# EAGLE design CMOS Clock battery (EAGLE 9.6.2)
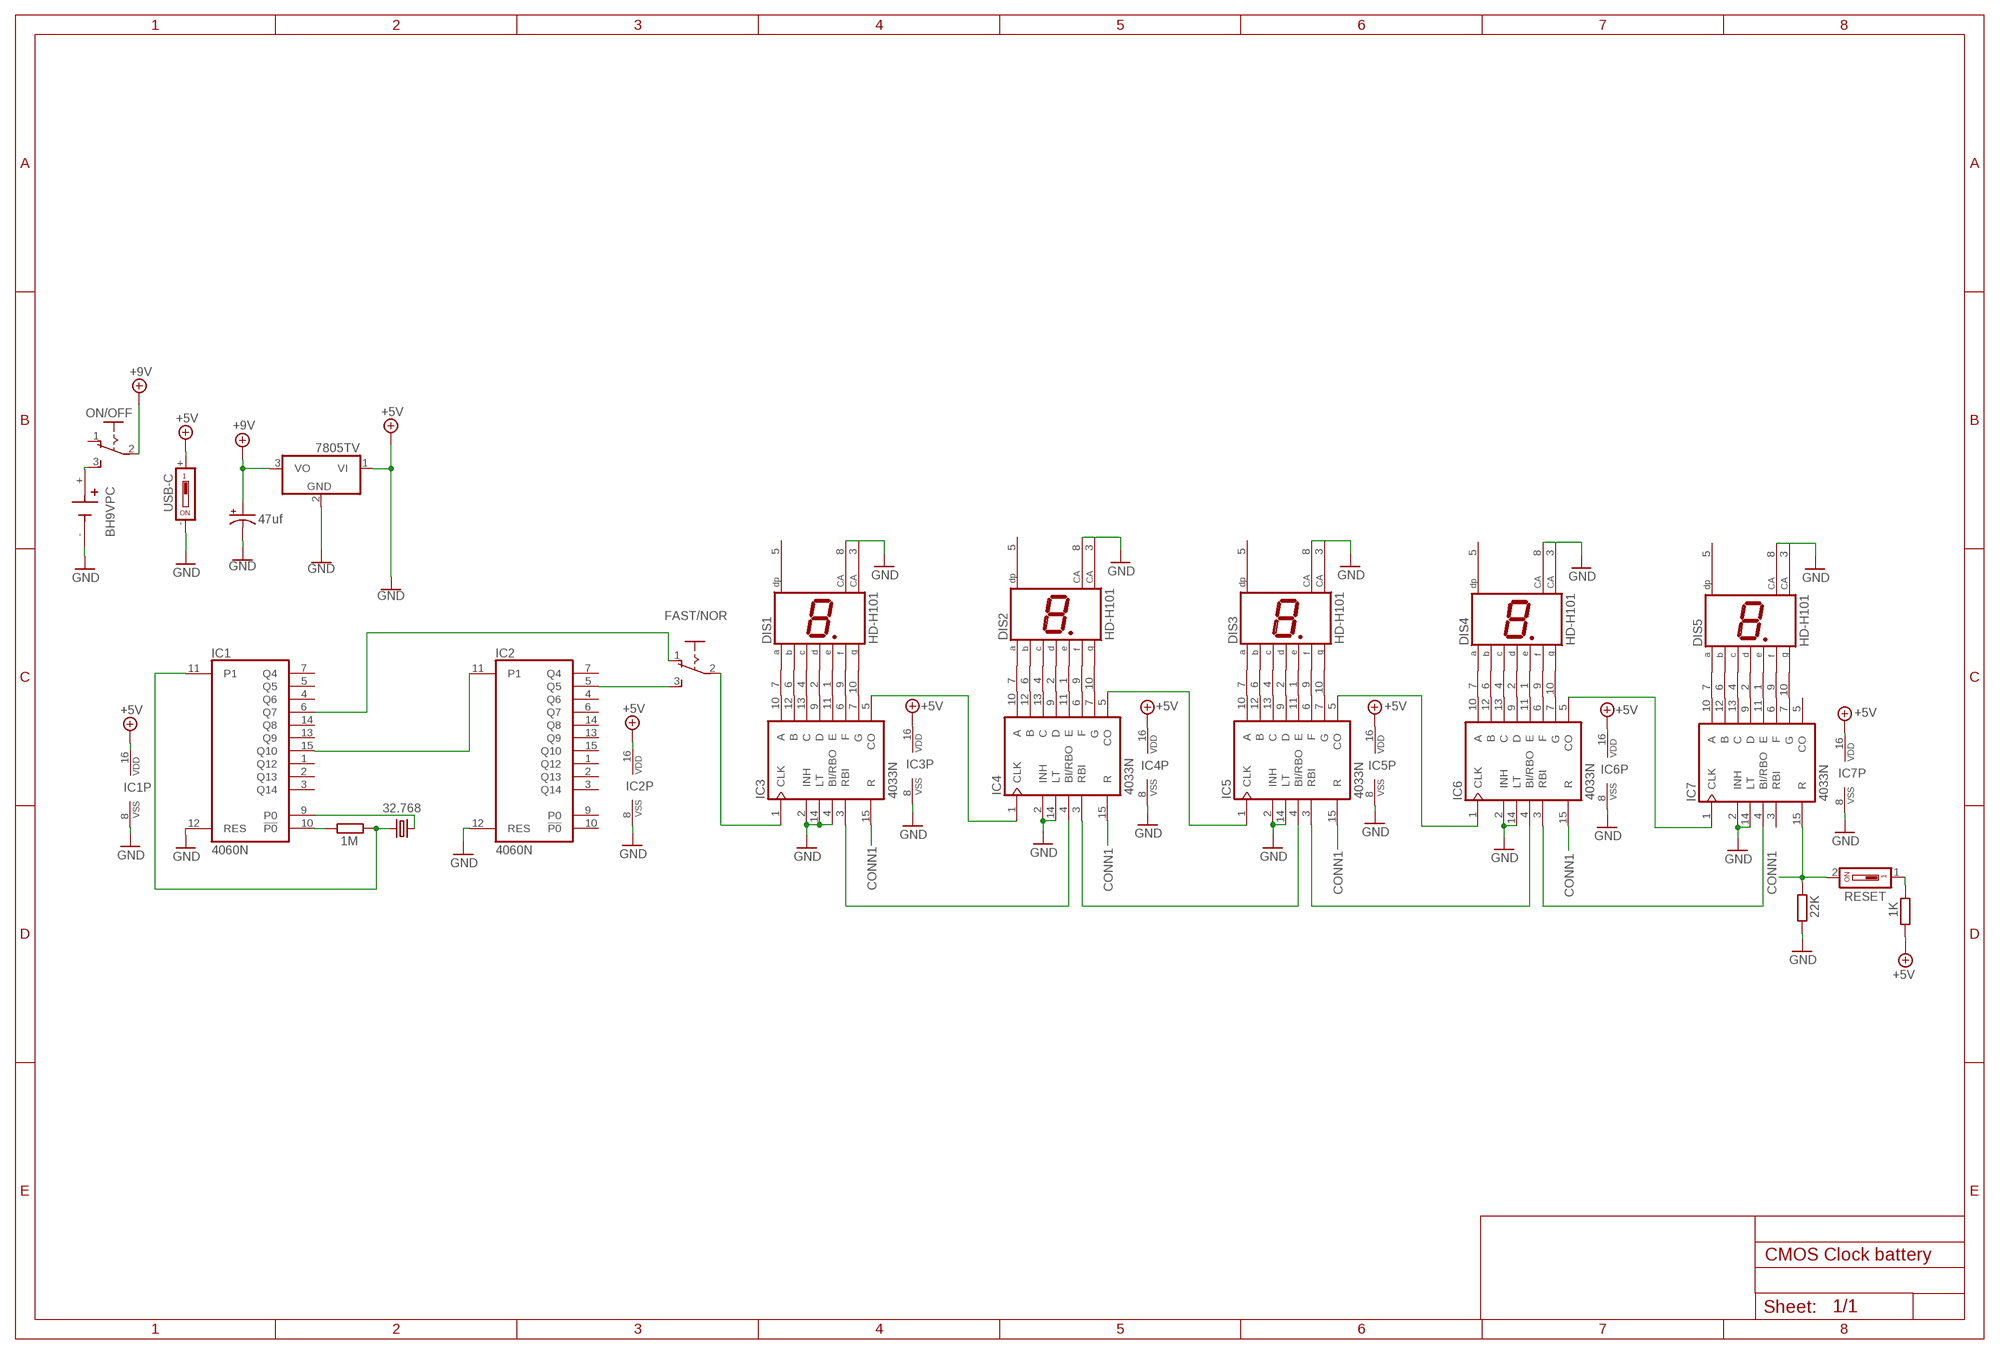
[diagram p0: schematic, sheet 1]

## Parts
BT1  BH9VPC  [BAT_BH9VPC]
C14  47uf  CPOL-USE2-5  [E2-5]
DIS1  HD-H101  [HDSP-M]
DIS2  HD-H101  [HDSP-M]
DIS3  HD-H101  [HDSP-M]
DIS4  HD-H101  [HDSP-M]
DIS5  HD-H101  [HDSP-M]
FAST/NOR  M251  [M251]
IC1  4060N  [DIL16]
IC2  4060N  [DIL16]
IC3  4033N  [DIL16]
IC4  4033N  [DIL16]
IC5  4033N  [DIL16]
IC6  4033N  [DIL16]
IC7  4033N  [DIL16]
IC8  7805TV  [TO220V]
ON/OFF  M251  [M251]
Q1  32.768  CRYSTALTC26H  [TC26H]
R1  1M  R-EU_0207/10  [0207/10]
R2  1K  R-EU_0207/10  [0207/10]
R3  22K  R-EU_0207/10  [0207/10]
RESET  DS01  [DS-01]
USB-C  USB-C  [DS-01]

## Nets
+5V: IC1.16(VDD) IC2.16(VDD) IC3.16(VDD) IC4.16(VDD) IC5.16(VDD) IC6.16(VDD) IC7.16(VDD) R2.2 USB-C.+
+9V: C14.+ IC8.3(VO) ON/OFF.2(P)
CONN1: IC3.15(R) IC4.15(R) IC5.15(R) IC6.15(R) IC7.15(R) R3.2 RESET.2
GND: BT1.- C14.- DIS1.3(CA) DIS1.8(CA) DIS2.3(CA) DIS2.8(CA) DIS3.3(CA) DIS3.8(CA) DIS4.3(CA) DIS4.8(CA) DIS5.3(CA) DIS5.8(CA) IC1.8(VSS) IC1.12(RES) IC2.8(VSS) IC2.12(RES) IC3.2(INH) IC3.4(BI/RBO) IC3.8(VSS) IC3.14(LT) IC4.2(INH) IC4.8(VSS) IC4.14(LT) IC5.2(INH) IC5.8(VSS) IC5.14(LT) IC6.2(INH) IC6.8(VSS) IC6.14(LT) IC7.2(INH) IC7.8(VSS) IC7.14(LT) IC8.1(VI) IC8.2(GND) R3.1 USB-C.- ; supply symbol labelled +5V
N$1: IC1.10(!P0) R1.1
N$2: IC1.11(P1) Q1.1 R1.2
N$3: IC1.9(P0) Q1.2
N$4: IC1.15(Q10) IC2.11(P1)
N$5: FAST/NOR.3(S) IC2.5(Q5)
N$6: DIS1.9(F) IC3.6(F)
N$7: DIS1.10(G) IC3.7(G)
N$8: DIS1.2(D) IC3.9(D)
N$9: DIS1.7(A) IC3.10(A)
N$10: DIS1.1(E) IC3.11(E)
N$11: DIS1.6(B) IC3.12(B)
N$12: DIS1.4(C) IC3.13(C)
N$13: IC3.5(CO) IC4.1(CLK)
N$14: IC4.5(CO) IC5.1(CLK)
N$15: DIS2.9(F) IC4.6(F)
N$16: DIS2.10(G) IC4.7(G)
N$17: DIS2.2(D) IC4.9(D)
N$18: DIS2.7(A) IC4.10(A)
N$19: DIS2.1(E) IC4.11(E)
N$20: DIS2.6(B) IC4.12(B)
N$21: DIS2.4(C) IC4.13(C)
N$22: IC5.5(CO) IC6.1(CLK)
N$23: IC6.5(CO) IC7.1(CLK)
N$24: DIS3.9(F) IC5.6(F)
N$25: DIS3.10(G) IC5.7(G)
N$26: DIS3.2(D) IC5.9(D)
N$27: DIS3.7(A) IC5.10(A)
N$28: DIS3.1(E) IC5.11(E)
N$29: DIS3.6(B) IC5.12(B)
N$30: DIS3.4(C) IC5.13(C)
N$31: IC3.3(RBI) IC4.4(BI/RBO)
N$32: IC4.3(RBI) IC5.4(BI/RBO)
N$33: R2.1 RESET.1
N$34: DIS4.9(F) IC6.6(F)
N$35: DIS4.10(G) IC6.7(G)
N$36: DIS4.2(D) IC6.9(D)
N$37: BT1.+ ON/OFF.3(S)
N$38: DIS4.7(A) IC6.10(A)
N$39: DIS4.1(E) IC6.11(E)
N$40: DIS4.6(B) IC6.12(B)
N$41: DIS4.4(C) IC6.13(C)
N$42: IC5.3(RBI) IC6.4(BI/RBO)
N$43: IC6.3(RBI) IC7.4(BI/RBO)
N$44: DIS5.9(F) IC7.6(F)
N$45: FAST/NOR.2(P) IC3.1(CLK)
N$46: DIS5.10(G) IC7.7(G)
N$47: DIS5.2(D) IC7.9(D)
N$48: DIS5.7(A) IC7.10(A)
N$49: DIS5.1(E) IC7.11(E)
N$50: DIS5.6(B) IC7.12(B)
N$51: DIS5.4(C) IC7.13(C)
N$52: FAST/NOR.1(O) IC1.6(Q7)
Unconnected: DIS1.5(DP) DIS2.5(DP) DIS3.5(DP) DIS4.5(DP) DIS5.5(DP) IC1.1(Q12) IC1.2(Q13) IC1.3(Q14) IC1.4(Q6) IC1.5(Q5) IC1.7(Q4) IC1.13(Q9) IC1.14(Q8) IC2.1(Q12) IC2.2(Q13) IC2.3(Q14) IC2.4(Q6) IC2.6(Q7) IC2.7(Q4) IC2.9(P0) IC2.10(!P0) IC2.13(Q9) IC2.14(Q8) IC2.15(Q10) IC7.3(RBI) IC7.5(CO) ON/OFF.1(O)

## Library data of the parts
BT1 = BH9VPC:BH9VPC: 9V Battery Holder Check prices <https://pricing.snapeda.com/parts/BH9VPC/MPD%20%28Memory%20Protection%20Devices%29/view-part?ref=eda>; AVAILABILITY: Warning; DESCRIPTION: BATTERY HOLDER 9V PC PIN; MF: MPD (Memory Protection Devices); MP: BH9VPC; PACKAGE: None; PRICE: None; PURCHASE-URL: https://pricing.snapeda.com/search/part/BH9VPC/?ref=eda
C14 = rcl:CPOL-US: POLARIZED CAPACITOR, American symbol; SPICEPREFIX: C
DIS1-DIS5 = display-hp:HD-H101: LED DISPLAY 1-character 7 segment, decimal point right; OC_FARNELL: unknown; OC_NEWARK: unknown
FAST/NOR ON/OFF = switches M Dunn:M251: SLIDING SWITCH Mors, distributor Buerklin, 11G702
IC1 IC2 = 40xx:4060: 14-stage binary/ripple COUNTER
IC3-IC7 = 40xx:4033: Decade COUNTER/DIVIDER, 7-seg. outputs
IC8 = linear:78*: Positive VOLTAGE REGULATOR Source: http://cache.national.com/ds/LM/LM78L05.pdf http://www.fairchildsemi.com/ds/LM/LM7805.pdf
Q1 = crystal:CRYSTAL: CRYSTAL; OC_FARNELL: unknown; OC_NEWARK: unknown
R1-R3 = rcl:R-EU_: RESISTOR, European symbol; SPICEPREFIX: R
RESET = 5mm SPST Switch:DS01: DIL/CODE SWITCH; OC_FARNELL: unknown; OC_NEWARK: unknown
USB-C = USB C:USB-C: DIL/CODE SWITCH; OC_FARNELL: unknown; OC_NEWARK: unknown

## Board
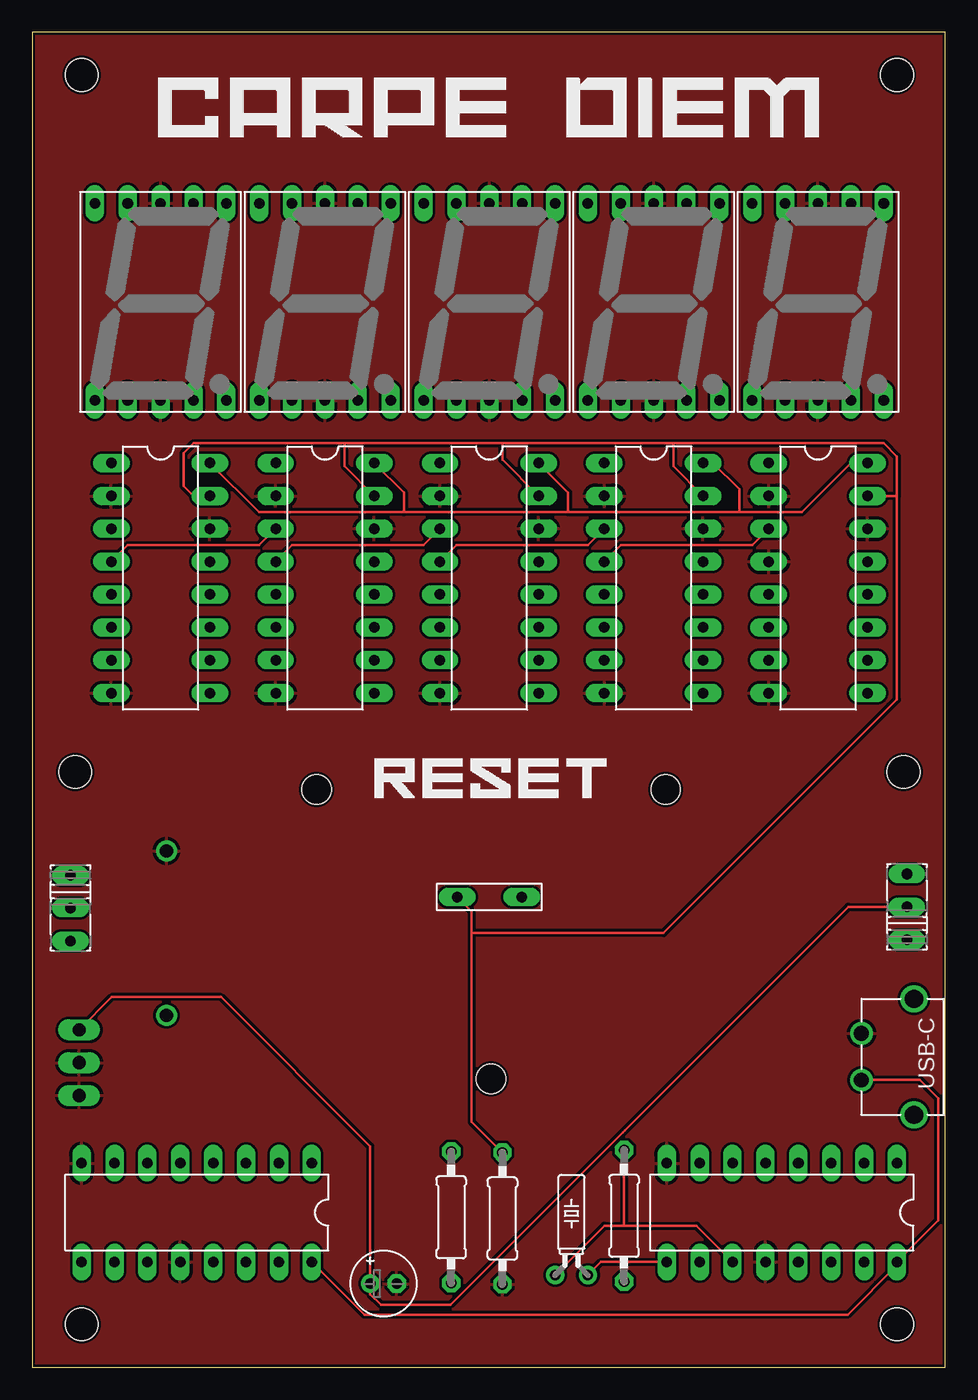
[diagram p1: board, top side]
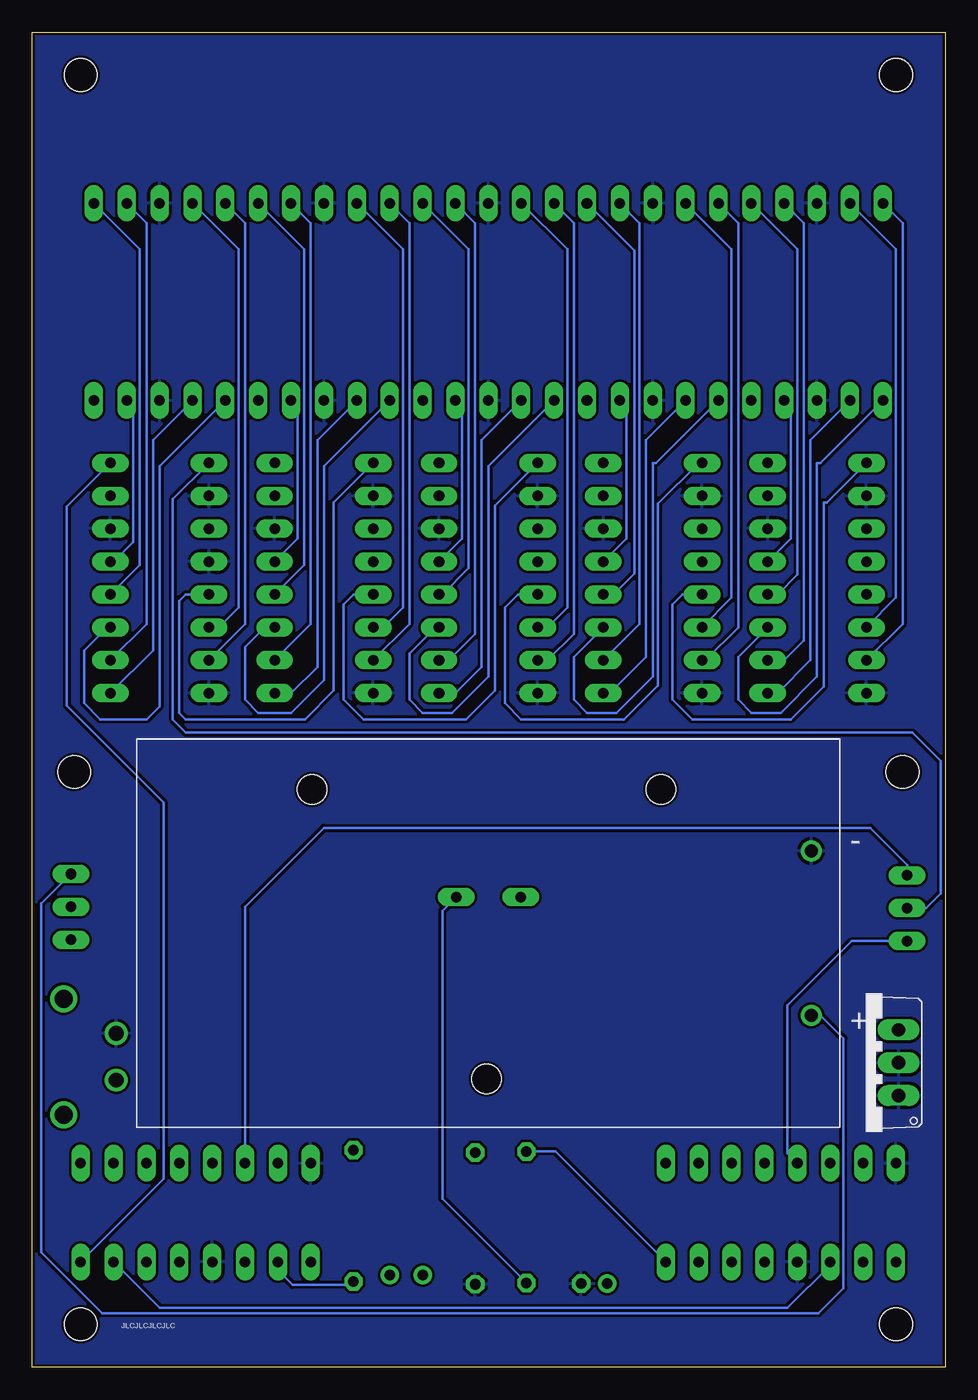
[diagram p2: board, bottom side, seen from below]

Size 70.54 x 103.11 mm. Coordinates in mm from the lower left corner, seen from the top.
Outline: 0,0 70.54,0 70.54,103.11 0,103.11 0,0
Copper layers (1*16): Top 0.035mm / dielectric 1.5mm / Bottom 0.035mm
Design rules "SparkFun": minimum track width 8mil, minimum drill 20mil, track to track 8mil, track to pad 8mil, pad to pad 8mil, via to via 8mil, smd to smd 8mil, copper to edge 8mil, drill to drill 8mil, minimum pad ring 12mil, minimum via ring 10mil, stop-mask expansion 4mil, vias tented up to drill 20mil, thermal gap 10mil
Holes 2.54 mm at 3.81,3.3 66.8,3.3 3.81,99.82 66.8,99.82 3.3,45.97 67.31,45.97

### Footprints (pad centres in the part's own frame; a part is rotated, then mirrored left to right if it is on the bottom)
BAT_BH9VPC = drill 1.016: + 24.945,-6.35; - 24.945,6.35 | hole 2.29: -0.135,-11.26; -13.625,11.09; 13.345,11.09
E2-5 = drill 0.813 pad 1.27: + -1.016,0 | drill 0.813 pad 1.27 octagon: - 1.016,0
HDSP-M = drill 0.813 long: 1 -5.08,-7.62; 2 -2.54,-7.62; 3 0,-7.62; 4 2.54,-7.62; 5 5.08,-7.62; 6 5.08,7.62; 7 2.54,7.62; 8 0,7.62; 9 -2.54,7.62; 10 -5.08,7.62
M251 = drill 0.813 long: 1 -2.54,0; 2 0,0; 3 2.54,0
DIL16 = drill 0.813 long: 1 -8.89,-3.81; 2 -6.35,-3.81; 3 -3.81,-3.81; 4 -1.27,-3.81; 5 1.27,-3.81; 6 3.81,-3.81; 7 6.35,-3.81; 8 8.89,-3.81; 9 8.89,3.81; 10 6.35,3.81; 11 3.81,3.81; 12 1.27,3.81; 13 -1.27,3.81; 14 -3.81,3.81; 15 -6.35,3.81; 16 -8.89,3.81
TO220V = drill 1.016 long: 1 -2.54,-2.54; 2 0,-2.54; 3 2.54,-2.54
TC26H = drill 0.813: 1 -1.27,0; 2 1.27,0
0207/10 = drill 0.813 octagon: 1 -5.08,0; 2 5.08,0
DS-01 = drill 0.813 long: 1 2.489,0; 2 -2.489,0
DS-01' = drill 1.397: 1 -4.077,-0.152; 2 4.889,-0.152 | drill 1.143: + 2.21,-4.216; - -1.397,-4.216

### Placement (x,y rotation side)
BT1  35.31,33.53 0 bottom
C14  27.13,6.45 0 top
DIS1  60.71,82.3 0 top
DIS2  48.01,82.3 0 top
DIS3  35.31,82.3 0 top
DIS4  22.61,82.3 0 top
DIS5  9.91,82.3 0 top
FAST/NOR  2.95,35.46 270 top
IC1  57.91,11.94 180 top
IC2  12.7,11.94 180 top
IC3  60.71,60.96 270 top
IC4  48.01,60.96 270 top
IC5  35.31,60.96 270 top
IC6  22.61,60.96 270 top
IC7  9.91,60.96 270 top
IC8  6.15,23.52 90 bottom
ON/OFF  67.56,35.56 90 top
Q1  41.66,7.11 0 top
R1  45.72,11.68 90 top
R2  32.36,11.58 90 top
R3  36.32,11.48 90 top
RESET  35.31,36.32 0 top
USB-C  [DS-01']  68.28,24.38 270 top

### Tracks (layer width: path | path; a pad name or v marks a point on that pad's centre or on a via)
+5V
  Top 0.203: IC2.16 25.65,4.06 62.99,4.06 66.8,7.87 IC1.16 70,11.33 70,20.75 68.58,22.17 USB-C.+ | IC7.16 17.53,66.04 28.7,66.04 | 41.4,66.04 54.61,66.04 | 41.4,66.04 28.7,66.04 | 54.61,66.04 54.61,67.82 52.58,69.85 IC4.16 | IC5.16 41.4,67.56 41.4,66.04 | IC6.16 28.7,67.56 28.7,66.04 | 54.61,66.04 59.44,66.04 63.25,69.85 IC3.16
  Bottom 0.203: IC3.16 67.87,66.5 67.87,51.11 60.4,43.64 60.4,14.53 IC1.16 | R2.2 30.12,16.66 IC2.16
+9V
  Top 0.203: IC8.3 6.15,28.6 14.58,28.6 26.11,17.07 C14.+ 26.11,5.64 26.92,4.83 32.31,4.83 45.62,18.14 45.77,18.29 63.04,35.56 ON/OFF.2
CONN1
  Top 0.203: IC7.15 12.45,67.31 11.68,68.07 11.68,70.61 12.45,71.37 24.13,71.37 | 24.13,71.37 36.32,71.37 | 36.32,71.37 49.53,71.37 | 49.53,71.37 65.79,71.37 66.8,70.36 66.8,67.31 | 66.8,67.31 IC3.15 | IC6.15 24.13,69.6 24.13,71.37 | IC5.15 36.32,70.1 36.32,71.37 | IC4.15 49.53,69.6 49.53,71.37 | 66.8,67.31 66.8,51.56 48.77,33.53 33.93,33.53 | 33.93,33.53 33.93,18.95 R3.2 | RESET.2 33.93,35.2 33.93,33.53
GND
  pour Top: 0,103.12 70.61,103.12 70.61,0 0,0
  pour Bottom: 0,103.12 70.61,103.12 70.61,0 0,0
N$1
  Bottom 0.203: R1.1 45.97,6.35 50.44,6.35 51.56,7.47 IC1.10
N$2
  Top 0.203: Q1.1 44.2,10.92 45.72,10.92 | IC1.11 51.31,10.92 45.72,10.92 | R1.2 45.72,10.92
N$3
  Top 0.203: Q1.2 43.94,8.13 IC1.9
N$4
  Bottom 0.203: IC1.15 60.71,4.57 12.19,4.57 8.89,7.87 IC2.11
N$5
  Bottom 0.203: IC2.5 12.19,16.51 12.19,27.94 7.21,32.92 FAST/NOR.3
N$6
  Bottom 0.203: DIS1.9 54.61,86.36 54.61,58.67 56.13,57.15 IC3.6
N$7
  Bottom 0.203: DIS1.10 54.1,88.39 54.1,57.4 IC3.7
N$8
  Bottom 0.203: DIS1.2 61.21,71.63 61.21,55.37 IC3.9
N$9
  Bottom 0.203: DIS1.7 61.72,88.39 61.72,57.4 IC3.10
N$10
  Bottom 0.203: DIS1.1 60.71,69.6 60.71,51.05 61.72,50.04 65.28,50.04 66.55,51.31 66.55,55.37 64.77,57.15 IC3.11
N$11
  Bottom 0.203: DIS1.6 62.23,86.36 62.23,61.98 IC3.12
N$12
  Bottom 0.203: DIS1.4 62.74,74.17 62.74,63.75 64.26,62.23 IC3.13
N$13
  Bottom 0.203: IC4.1 47.24,66.8 47.24,52.26 49.46,50.04 58.67,50.04 59.18,50.55 59.18,59.18 58.67,59.69 IC3.5
N$14
  Bottom 0.203: IC5.1 34.8,66.55 34.8,52.26 37.02,50.04 44.96,50.04 46.48,51.56 46.48,58.93 45.72,59.69 IC4.5
N$15
  Bottom 0.203: DIS2.9 41.91,86.36 41.91,58.67 43.43,57.15 IC4.6
N$16
  Bottom 0.203: DIS2.10 41.4,88.39 41.4,57.4 IC4.7
N$17
  Bottom 0.203: DIS2.2 48.51,71.63 48.51,54.1 50.55,52.07 IC4.9
N$18
  Bottom 0.203: DIS2.7 49.02,88.39 49.02,57.4 IC4.10
N$19
  Bottom 0.203: DIS2.1 48.01,69.6 48.01,53.09 50.55,50.55 53.09,50.55 54.1,51.56 54.1,55.63 52.58,57.15 IC4.11
N$20
  Bottom 0.203: DIS2.6 49.53,86.36 49.53,61.98 IC4.12
N$21
  Bottom 0.203: DIS2.4 50.04,74.17 50.04,64.01 IC4.13
N$22
  Bottom 0.203: IC6.1 19.05,69.85 22.2,66.7 22.2,52.66 24.83,50.04 32.77,50.04 34.04,51.31 34.04,58.67 33.02,59.69 IC5.5
N$23
  Bottom 0.203: IC7.1 9.14,66.8 9.4,66.8 9.4,52.58 11.94,50.04 19.56,50.04 21.08,51.56 21.08,58.93 20.32,59.69 IC6.5
N$24
  Bottom 0.203: DIS3.9 29.21,86.36 29.21,58.67 30.73,57.15 IC5.6
N$25
  Bottom 0.203: DIS3.10 28.7,88.39 28.7,56.64 30.73,54.61 IC5.7
N$26
  Bottom 0.203: DIS3.2 35.81,71.63 35.81,54.1 37.85,52.07 IC5.9
N$27
  Bottom 0.203: DIS3.7 36.32,88.39 36.32,56.64 38.35,54.61 IC5.10
N$28
  Bottom 0.203: DIS3.1 35.31,69.6 35.31,53.34 38.1,50.55 40.39,50.55 41.4,51.56 41.4,55.12 39.37,57.15 IC5.11
N$29
  Bottom 0.203: DIS3.6 36.83,86.36 36.83,61.72 38.86,59.69 IC5.12
N$30
  Bottom 0.203: DIS3.4 37.34,74.17 37.34,64.01 IC5.13
N$31
  Top 0.203: IC4.4 45.47,63.5 55.63,63.5 IC3.3
N$32
  Top 0.203: IC5.4 32.77,63.5 42.93,63.5 IC4.3
N$33
  Bottom 0.203: R2.1 38.86,13.01 38.86,35.26 RESET.1
N$34
  Bottom 0.203: DIS4.9 16.51,86.36 16.51,59.44 IC6.6
N$35
  Bottom 0.203: DIS4.10 16,88.39 16,57.15 18.54,54.61 IC6.7
N$36
  Bottom 0.203: DIS4.2 23.11,71.63 23.11,54.86 25.91,52.07 IC6.9
N$37
  Bottom 0.203: BT1.+ 9.65,27.18 7.87,25.4 7.87,6.1 9.8,4.17 65.13,4.17 69.85,8.89 69.85,35.81 ON/OFF.3
N$38
  Bottom 0.203: DIS4.7 23.62,88.39 23.62,57.4 IC6.10
N$39
  Bottom 0.203: DIS4.1 22.35,69.85 22.61,69.85 22.61,53.34 25.4,50.55 27.69,50.55 28.7,51.56 28.7,54.86 IC6.11
N$40
  Bottom 0.203: DIS4.6 24.03,86.26 24.03,61.32 25.65,59.69 IC6.12
N$41
  Bottom 0.203: DIS4.4 24.64,74.17 24.64,64.01 IC6.13
N$42
  Top 0.203: IC6.4 20.07,63.5 30.23,63.5 IC5.3
N$43
  Top 0.203: IC7.4 7.37,63.5 17.53,63.5 IC6.3
N$44
  Bottom 0.203: DIS5.9 3.81,86.36 3.81,59.44 IC7.6
N$45
  Bottom 0.203: IC3.1 59.69,67.06 59.69,50.04 58.67,49.02 2.54,49.02 0.36,46.84 0.36,36.58 1.47,35.46 FAST/NOR.2
N$46
  Bottom 0.203: DIS5.10 3.3,88.39 3.3,57.4 IC7.7
N$47
  Bottom 0.203: DIS5.2 10.41,71.63 10.41,54.61 12.95,52.07 IC7.9
N$48
  Bottom 0.203: DIS5.7 10.92,88.39 10.92,56.13 12.45,54.61 IC7.10
N$49
  Bottom 0.203: DIS5.1 9.65,69.85 9.91,69.85 9.91,53.34 12.7,50.55 14.99,50.55 16,51.56 16,54.86 IC7.11
N$50
  Bottom 0.203: DIS5.6 11.43,86.36 11.43,61.21 12.95,59.69 IC7.12
N$51
  Bottom 0.203: DIS5.4 11.94,74.17 11.94,64.01 IC7.13
N$52
  Bottom 0.203: IC1.6 54.1,35.56 48.01,41.66 5.79,41.66 2.95,38.81 FAST/NOR.1

### Text on the board
bPlace: JLCJLCJLCJLC